# EAGLE schematic ReturnSlice (EAGLE 7.5.0)
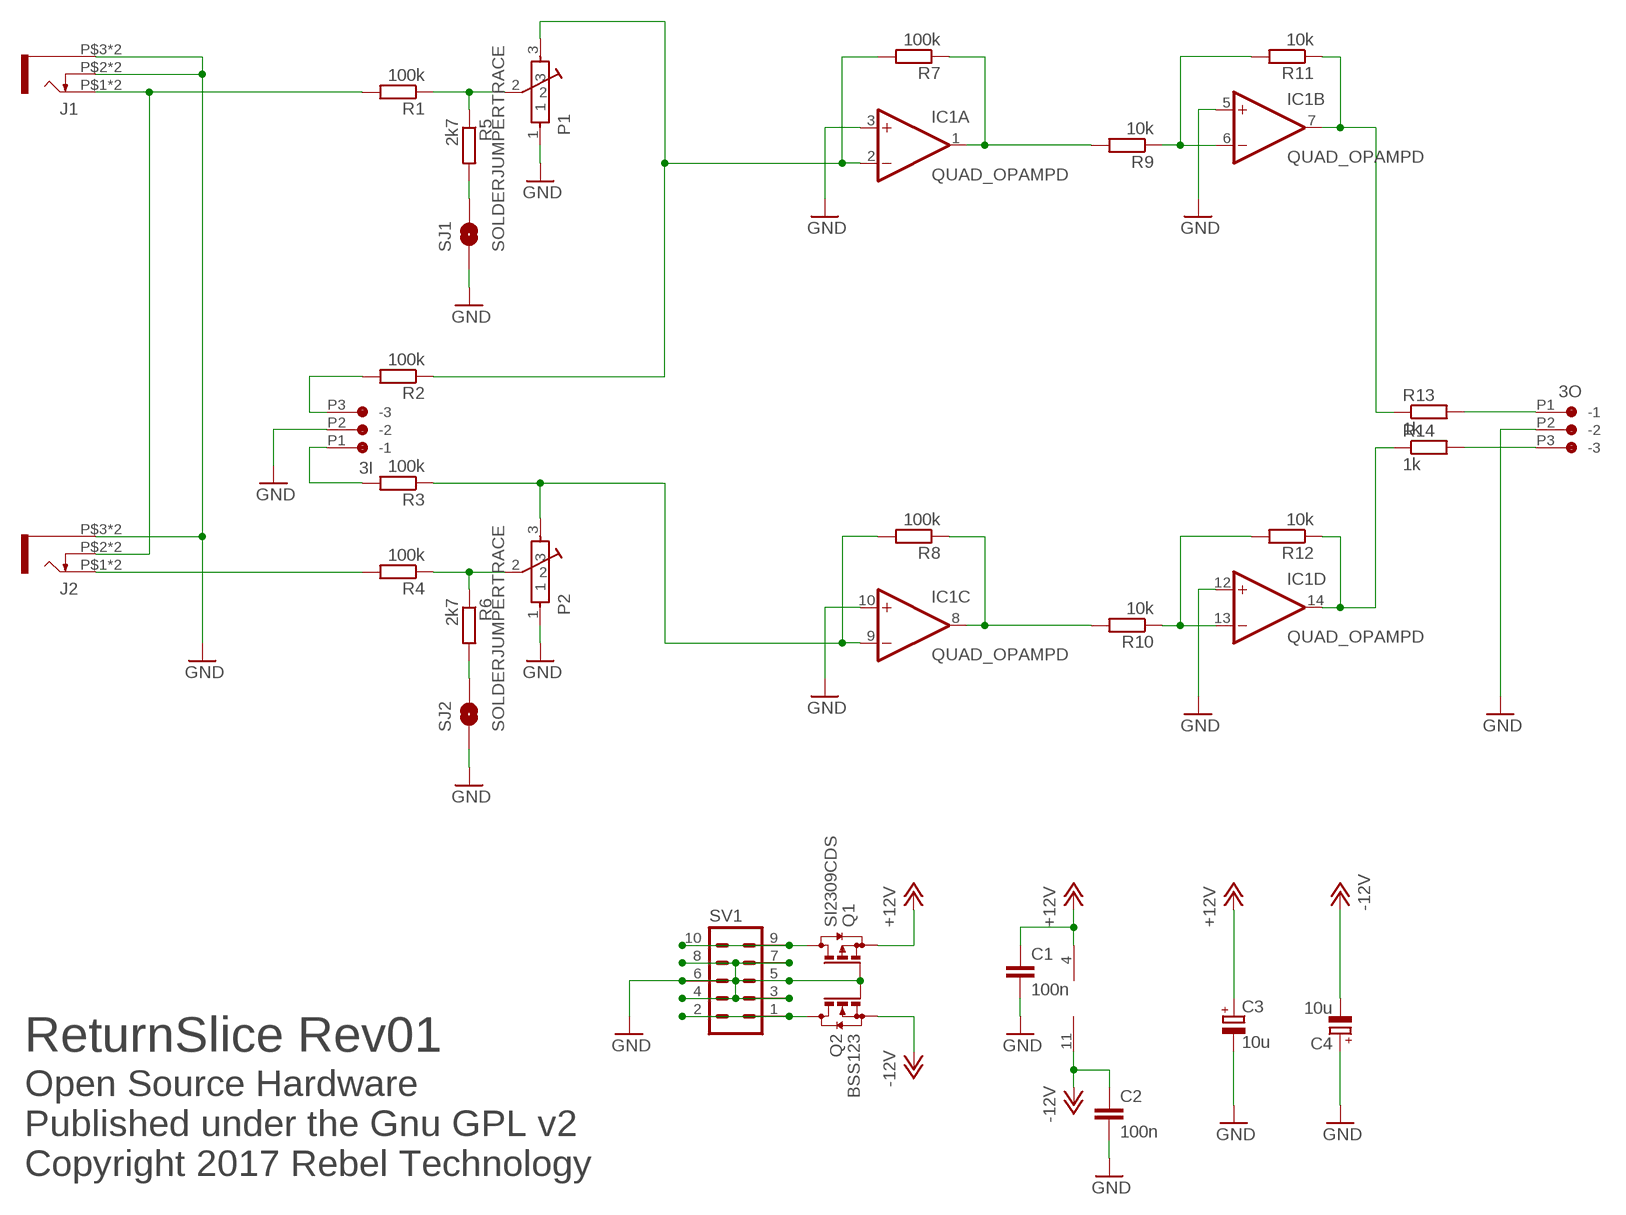
[diagram p0: schematic, sheet 1]

## Parts
3I  CON-JST_PH_3W  [CON-JST_PH_3W]
3O  CON-JST_PH_3W  [CON-JST_PH_3W]
C1  100n  C-EUC0603  [C0603]
C2  100n  C-EUC0603  [C0603]
C3  10u  CPOL-EU153CLV-0505  [153CLV-0505]
C4  10u  CPOL-EU153CLV-0505  [153CLV-0505]
IC1  QUAD_OPAMPD  [SO14]
J1  JACK-UJ-3502-RSLOT  [UJ-3502-R-SLOT]
J2  JACK-UJ-3502-RSLOT  [UJ-3502-R-SLOT]
P1  10k  POT-BOURNS-PTD901  [POT-BOURNS-PTD901]
P2  10k  POT-BOURNS-PTD901  [POT-BOURNS-PTD901]
Q1  SI2309CDS  BSS84  [SOT23]
Q2  BSS123  [SOT23]
R1  100k  R-EU_0603  [0603]
R2  100k  R-EU_0603  [0603]
R3  100k  R-EU_0603  [0603]
R4  100k  R-EU_0603  [0603]
R5  2k7  R-EU_0603  [0603]
R6  2k7  R-EU_0603  [0603]
R7  100k  R-EU_0603  [0603]
R8  100k  R-EU_0603  [0603]
R9  10k  R-EU_0603  [0603]
R10  10k  R-EU_0603  [0603]
R11  10k  R-EU_0603  [0603]
R12  10k  R-EU_0603  [0603]
R13  1k  R-EU_0603  [0603]
R14  1k  R-EU_0603  [0603]
SJ1  SOLDERJUMPERTRACE  [SJ_2S-TRACE]
SJ2  SOLDERJUMPERTRACE  [SJ_2S-TRACE]
SV1  MA05-2  [MA05-2]

## Nets
+12V: C1.1 C3.+ IC1.4(P:V+) Q1.2(S)
-12V: C2.1 C4.- IC1.11(P:V-) Q2.2(S)
GND: 3I.P2(-2) 3O.P2(-2) C1.2 C2.2 C3.- C4.+ IC1.3(A:+IN) IC1.5(B:+IN) IC1.10(C:+IN) IC1.12(D:+IN) J1.P$2(SW) J1.P$2B(SW) J1.P$3(SLEEVE) J1.P$3B(SLEEVE) J2.P$3(SLEEVE) J2.P$3B(SLEEVE) P1.1 P2.1 Q1.1(G) Q2.1(G) SJ1.1 SJ2.1 SV1.3 SV1.4 SV1.5 SV1.6 SV1.7 SV1.8
IN_A: 3I.P3(-3) R2.2
IN_L: J1.P$1(TIP) J1.P$1B(TIP) J2.P$2(SW) J2.P$2B(SW) R1.2
IN_R: J2.P$1(TIP) J2.P$1B(TIP) R4.2
N$1: Q2.3(D) SV1.1 SV1.2
N$3: R5.2 SJ1.2
N$4: R6.2 SJ2.2
N$5: IC1.9(C:-IN) P2.3 R3.1 R8.2
N$7: IC1.6(B:-IN) R9.1 R11.2
N$8: 3O.P1(-1) R13.2
N$9: 3O.P3(-3) R14.2
N$10: IC1.7(B:OUT) R11.1 R13.1
N$11: P2.2 R4.1 R6.1
N$13: P1.2 R1.1 R5.1
N$14: Q1.3(D) SV1.9 SV1.10
N$15: 3I.P1(-1) R3.2
N$16: IC1.2(A:-IN) P1.3 R2.1 R7.2
N$20: IC1.13(D:-IN) R10.1 R12.2
N$25: IC1.14(D:OUT) R12.1 R14.1
N$45: IC1.8(C:OUT) R8.1 R10.2
N$50: IC1.1(A:OUT) R7.1 R9.2

## Notes on the sheet
- ReturnSlice Rev01
- Open Source Hardware
  Published under the Gnu GPL v2
  Copyright 2017 Rebel Technology

## Library data of the parts
3I 3O = Rebel:CON-JST_PH_3W
C1 C2 = Rebel:C-EU: CAPACITOR, European symbol
C3 C4 = rcl:CPOL-EU: POLARIZED CAPACITOR, European symbol
IC1 = adafruit:QUAD_OPAMP: OP AMP Standard quad package
J1 J2 = Rebel:JACK-UJ-3502-R
P1 P2 = Rebel:POT-BOURNS-PTD901
Q1 = transistor-small-signal:BSS84: P-CHANNEL MOS FET
Q2 = transistor-small-signal:BSS123: N-CHANNEL MOS FET
R1-R14 = Rebel:R-EU_: RESISTOR, European symbol
SJ1 SJ2 = SparkFun:SOLDERJUMPER: Solder Jumper Standard SMD solder jumper. Used to automate production. Two varients : Normally Open and Normally Closed are the same, but have different paste layers. NC will have a large amount of paste and should jumper during reflow.
SV1 = con-lstb:MA05-2: PIN HEADER; OC_FARNELL: unknown; OC_NEWARK: unknown